# EAGLE board LCD-OLINUXINO-10''TS (EAGLE 4.16)
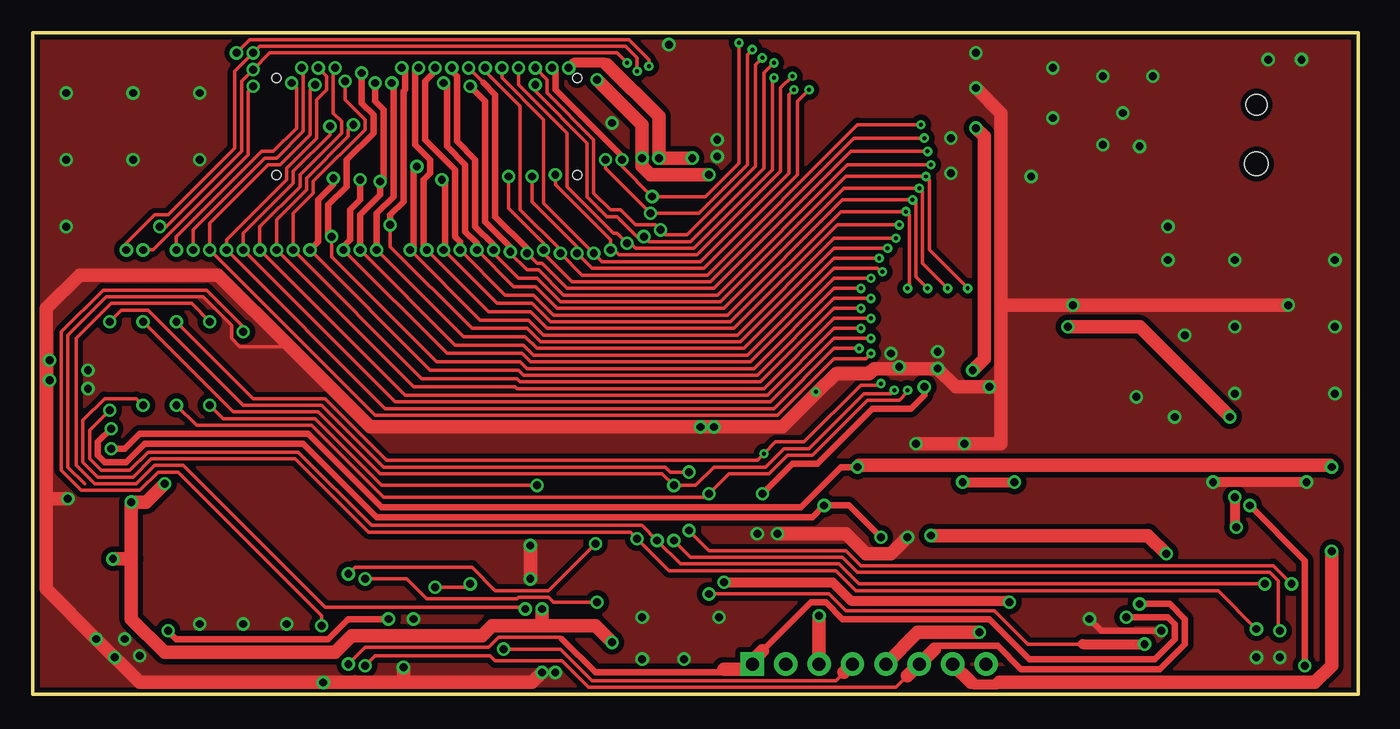
[diagram p1: board, top side]
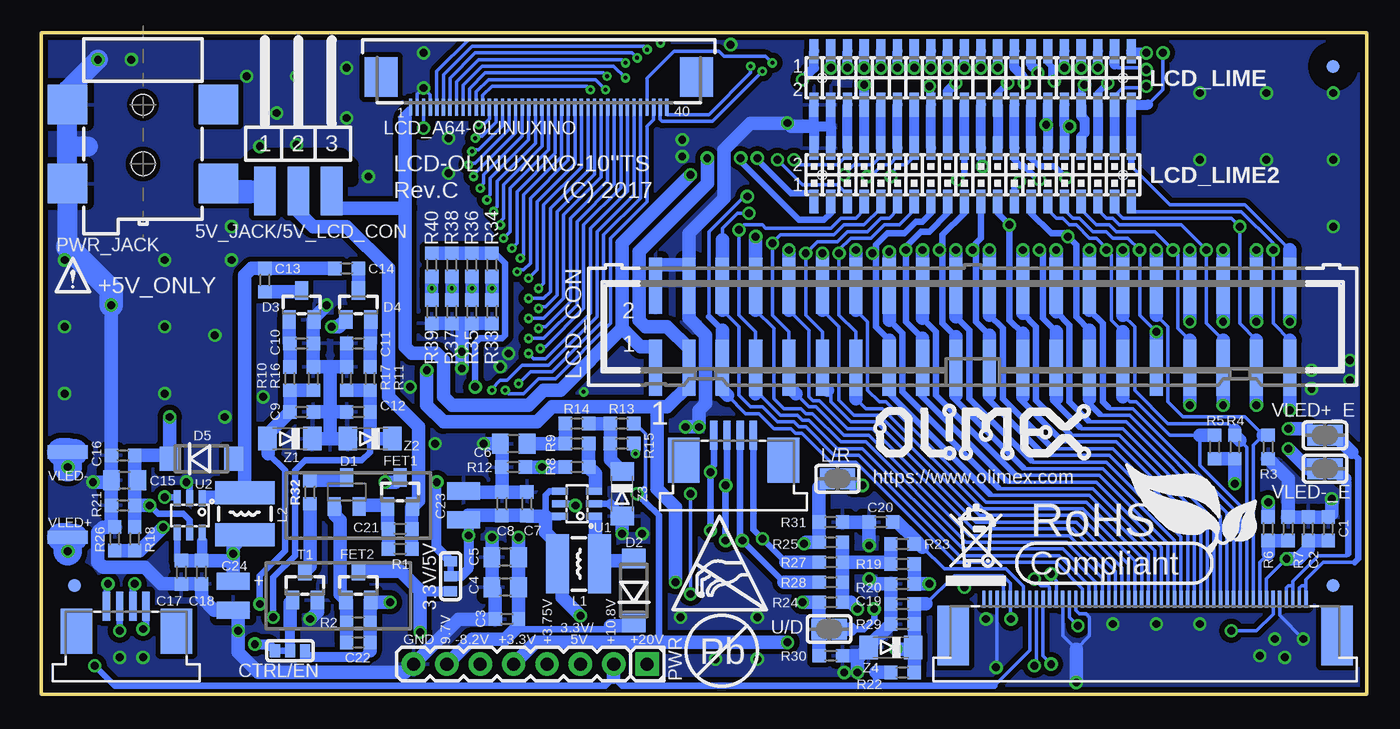
[diagram p2: board, bottom side, seen from below]

Size 100.84 x 50.29 mm. Coordinates in mm from the lower left corner, seen from the top.
Outline: 0,0 100.84,0 100.84,50.29 0,50.29 0,0
Copper layers (1+16): Top 0.035mm / dielectric 1.5mm / Bottom 0.035mm
Design rules "default": minimum track width 9.5mil, minimum drill 0.3mm, track to track 9mil, track to pad 9mil, pad to pad 9.5mil, via to via 9.5mil, smd to smd 1mil, copper to edge 10mil, drill to drill 8mil, minimum pad ring 8mil, minimum via ring 8mil, stop-mask expansion 4mil, vias tented up to drill 25mil, thermal gap 20mil
Net classes: 1 pwr: width 0.254 mm, drill 0.241 mm, clearance 0.254 mm
bRestrict: 6 lines

## Footprints (pad centres in the part's own frame; a part is rotated, then mirrored left to right if it is on the bottom)
SJ_2_SMALL_12_TIED = smd 0.762 x 1.016: 1 -1.143,0; 2 0,0; 3 1.143,0
HN1X3-SMD = smd 1.651 x 3.683: 1 -2.54,-0.229; 2 0,-0.229; 3 2.54,-0.229
C0603_DWS = smd 1.016 x 1.016: 1 -0.889,0; 2 0.889,0
C0805_5MIL_DWS = smd 1.27 x 1.524: 1 -1.016,0; 2 1.016,0
C-SMD5X11-M = smd 2.5 x 1.3: + 0,-1.1; - 0,1.1
SJ_2_SMALL_23_TIED = smd 0.762 x 1.016: 1 -1.143,0; 2 0,0; 3 1.143,0
SOT23C = smd 1.4 x 1: 1 1.1,-0.95; 2 1.1,0.95; 3 -1.1,0
MLL-41 = smd 1.45 x 1.8: A 2.445,0; K -2.445,0
SOT23C(BAT54S) = smd 1.4 x 1: 1 1.1,-0.95; 2 1.1,0.95; 3 -1.1,0
SOT23 = smd 1.4 x 1: 1 1.1,-0.95; 2 1.1,0.95; 3 -1.1,0
CD42(43) = smd 1.75 x 4.5: 1 -1.6,0; 2 1.6,0
SJ = smd 1.168 x 1.6: 1 -0.762,0; 2 0.762,0
LCD10"_TOUCH(F101T50) = smd 0.25 x 1.3 bottom: 1 104.95,54.35; 2 105.45,54.35; 3 105.95,54.35; 4 106.45,54.35; 5 106.95,54.35; 6 107.45,54.35; 7 107.95,54.35; 8 108.45,54.35; 9 108.95,54.35; 10 109.45,54.35; 11 109.95,54.35; 12 110.45,54.35; 13 110.95,54.35; 14 111.45,54.35; 15 111.95,54.35; 16 112.45,54.35; 17 112.95,54.35; 18 113.45,54.35; 19 113.95,54.35; 20 114.45,54.35; 21 114.95,54.35; 22 115.45,54.35; 23 115.95,54.35; 24 116.45,54.35; 25 116.95,54.35; 26 117.45,54.35; 27 117.95,54.35; 28 118.45,54.35; 29 118.95,54.35; 30 119.45,54.35; 31 119.95,54.35; 32 120.45,54.35; 33 120.95,54.35; 34 121.45,54.35; 35 121.95,54.35; 36 122.45,54.35; 37 122.95,54.35; 38 123.45,54.35; 39 123.95,54.35; 40 124.45,54.35; 41 124.95,54.35; 42 125.45,54.35; 43 125.95,54.35; 44 126.45,54.35; 45 126.95,54.35; 46 127.45,54.35; 47 127.95,54.35; 48 128.45,54.35; 49 128.95,54.35; 50 129.45,54.35 | smd 0.55 x 2.2 bottom: 51 193.195,53.799; 52 194.195,53.799; 53 195.195,53.799; 54 196.195,53.799; 55 146.995,66.799; 56 147.995,66.799; 57 148.995,66.799; 58 149.995,66.799 | smd 2.4 x 4.5 bottom: P1 131.8,51.575; P2 102.6,51.575 | smd 2.4 x 3.4 bottom: P3 190.895,51.899; P4 198.495,51.899; P5 144.695,64.899; P6 152.295,64.899
FPV-WZA21-40-LF = smd 0.25 x 1.3: 1 -9.75,-2.75; 2 -9.25,-2.75; 3 -8.75,-2.75; 4 -8.25,-2.75; 5 -7.75,-2.75; 6 -7.25,-2.75; 7 -6.75,-2.75; 8 -6.25,-2.75; 9 -5.75,-2.75; 10 -5.25,-2.75; 11 -4.75,-2.75; 12 -4.25,-2.75; 13 -3.75,-2.75; 14 -3.25,-2.75; 15 -2.75,-2.75; 16 -2.25,-2.75; 17 -1.75,-2.75; 18 -1.25,-2.75; 19 -0.75,-2.75; 20 -0.25,-2.75; 21 0.25,-2.75; 22 0.75,-2.75; 23 1.25,-2.75; 24 1.75,-2.75; 25 2.25,-2.75; 26 2.75,-2.75; 27 3.25,-2.75; 28 3.75,-2.75; 29 4.25,-2.75; 30 4.75,-2.75; 31 5.25,-2.75; 32 5.75,-2.75; 33 6.25,-2.75; 34 6.75,-2.75; 35 7.25,-2.75; 36 7.75,-2.75; 37 8.25,-2.75; 38 8.75,-2.75; 39 9.25,-2.75; 40 9.75,-2.75 | smd 2.5 x 3: P1 12,-0.45; P2 -12,-0.45
ML40-MALE(GBH-254-SMT-40) = smd 1 x 4.25: 1 -24.13,-3.125; 2 -24.13,3.125; 3 -21.59,-3.125; 4 -21.59,3.125; 5 -19.05,-3.125; 6 -19.05,3.125; 7 -16.51,-3.125; 8 -16.51,3.125; 9 -13.97,-3.125; 10 -13.97,3.125; 11 -11.43,-3.125; 12 -11.43,3.125; 13 -8.89,-3.125; 14 -8.89,3.125; 15 -6.35,-3.125; 16 -6.35,3.125; 17 -3.81,-3.125; 18 -3.81,3.125; 19 -1.27,-3.125; 20 -1.27,3.125; 21 1.27,-3.125; 22 1.27,3.125; 23 3.81,-3.125; 24 3.81,3.125; 25 6.35,-3.125; 26 6.35,3.125; 27 8.89,-3.125; 28 8.89,3.125; 29 11.43,-3.125; 30 11.43,3.125; 31 13.97,-3.125; 32 13.97,3.125; 33 16.51,-3.125; 34 16.51,3.125; 35 19.05,-3.125; 36 19.05,3.125; 37 21.59,-3.125; 38 21.59,3.125; 39 24.13,-3.125; 40 24.13,3.125
YA-V36P-2X20-LF = smd 0.7 x 1.8: 1 -12.065,2.032; 2 -12.065,-2.032; 3 -10.795,2.032; 4 -10.795,-2.032; 5 -9.525,2.032; 6 -9.525,-2.032; 7 -8.255,2.032; 8 -8.255,-2.032; 9 -6.985,2.032; 10 -6.985,-2.032; 11 -5.715,2.032; 12 -5.715,-2.032; 13 -4.445,2.032; 14 -4.445,-2.032; 15 -3.175,2.032; 16 -3.175,-2.032; 17 -1.905,2.032; 18 -1.905,-2.032; 19 -0.635,2.032; 20 -0.635,-2.032; 21 0.635,2.032; 22 0.635,-2.032; 23 1.905,2.032; 24 1.905,-2.032; 25 3.175,2.032; 26 3.175,-2.032; 27 4.445,2.032; 28 4.445,-2.032; 29 5.715,2.032; 30 5.715,-2.032; 31 6.985,2.032; 32 6.985,-2.032; 33 8.255,2.032; 34 8.255,-2.032; 35 9.525,2.032; 36 9.525,-2.032; 37 10.795,2.032; 38 10.795,-2.032; 39 12.065,2.032; 40 12.065,-2.032 | hole 0.7: -11.43,0; 11.43,0
GPH127SMT-02X20(PA-V16X-2X20-LF) = smd 0.7 x 1.8: 1 -12.065,-2.032; 2 -12.065,2.032; 3 -10.795,-2.032; 4 -10.795,2.032; 5 -9.525,-2.032; 6 -9.525,2.032; 7 -8.255,-2.032; 8 -8.255,2.032; 9 -6.985,-2.032; 10 -6.985,2.032; 11 -5.715,-2.032; 12 -5.715,2.032; 13 -4.445,-2.032; 14 -4.445,2.032; 15 -3.175,-2.032; 16 -3.175,2.032; 17 -1.905,-2.032; 18 -1.905,2.032; 19 -0.635,-2.032; 20 -0.635,2.032; 21 0.635,-2.032; 22 0.635,2.032; 23 1.905,-2.032; 24 1.905,2.032; 25 3.175,-2.032; 26 3.175,2.032; 27 4.445,-2.032; 28 4.445,2.032; 29 5.715,-2.032; 30 5.715,2.032; 31 6.985,-2.032; 32 6.985,2.032; 33 8.255,-2.032; 34 8.255,2.032; 35 9.525,-2.032; 36 9.525,2.032; 37 10.795,-2.032; 38 10.795,2.032; 39 12.065,-2.032; 40 12.065,2.032 | hole 0.7: -11.43,0; 11.43,0
HN1X8 = drill 1 pad 1.778 square: 1 -8.89,0 | drill 1 pad 1.778 round: 2 -6.35,0; 3 -3.81,0; 4 -1.27,0; 5 1.27,0; 6 3.81,0; 7 6.35,0; 8 8.89,0
PWR-JACK-SMD = smd 3 x 3: 1 6,5.75; 2 0,-5.75; 3 6,-5.75; 4 0,5.75 | hole 1.6: 0,0 | hole 1.8: 4.5,0
R0603_5MIL_DWS = smd 1.016 x 1.016: 1 -0.889,0; 2 0.889,0
SOT-23 = smd 1.4 x 1: 1 1.1,-0.95; 2 1.1,0.95; 3 -1.1,0
SOT23-6 = smd 1.2 x 0.55: 1 1.3,-0.95; 2 1.3,0; 3 1.3,0.95; 4 -1.3,0.95; 5 -1.3,0; 6 -1.3,-0.95
FIDUCIAL-1X3 = smd 1 x 1: 1 0,0
SMD120X40 = smd 3.048 x 1.016: 1 0,0
MINI-MELF = smd 1.4 x 1.8: 1 -1.7,0; 2 1.7,0

## Placement (x,y rotation side)
3.3V/5V  5V:Close/3.3V:Open  [SJ_2_SMALL_12_TIED]  69.69,8.97 270 bottom
5V_JACK/5V_LCD_CON  H-WX-1x3  [HN1X3-SMD]  81.28,38.48 0 bottom
C1  22uF/6.3V  [C0603_DWS]  2.92,12.57 90 bottom
C2  100nF  [C0603_DWS]  4.45,12.57 90 bottom
C3  100nF  [C0603_DWS]  65.41,5.71 180 bottom
C4  1uF/25V  [C0805_5MIL_DWS]  65.53,8.13 180 bottom
C5  1uF/25V  [C0805_5MIL_DWS]  65.53,10.41 180 bottom
C6  10uF/16V  [C0805_5MIL_DWS]  64.9,19.05 180 bottom
C7  22uF/6.3V  [C0603_DWS]  63.88,14.48 270 bottom
C8  22uF/6.3V  [C0603_DWS]  65.79,14.48 270 bottom
C9  100nF  [C0603_DWS]  81.03,21.46 0 bottom
C10  100nF  [C0603_DWS]  81.03,26.67 0 bottom
C11  100nF  [C0603_DWS]  76.71,26.67 180 bottom
C12  100nF  [C0603_DWS]  76.71,21.46 180 bottom
C13  100nF  [C0603_DWS]  83.82,31.5 90 bottom
C14  100nF  [C0603_DWS]  77.6,32.38 0 bottom
C15  10uF/16V  [C0805_5MIL_DWS]  94.49,16.26 180 bottom
C16  100nF  [C0603_DWS]  94.61,18.16 180 bottom
C17  22uF/6.3V  [C0603_DWS]  90.17,9.27 90 bottom
C18  22uF/6.3V  [C0603_DWS]  88.65,9.27 90 bottom
C19  100nF  [C0603_DWS]  35.31,6.86 180 bottom
C20  100nF  [C0603_DWS]  36.96,13.08 180 bottom
C21  22uF/6.3V  [C0603_DWS]  73.53,12.57 180 bottom
C22  100nF  [C0603_DWS]  76.71,3.94 180 bottom
C23  NA(100uF/16V)  [C-SMD5X11-M]  68.71,14.35 0 bottom
C24  NA(100uF/16V)  [C-SMD5X11-M]  86.23,7.49 180 bottom
CTRL/EN  CTRL:Close/EN:Open  [SJ_2_SMALL_23_TIED]  81.92,3.3 180 bottom
D1  BAT54C  [SOT23C]  77.6,15.37 270 bottom
D2  1N5819/SS14  [MLL-41]  55.75,7.87 90 bottom
D3  BAT54S  [SOT23C(BAT54S)]  81.03,29.59 270 bottom
D4  BAT54S  [SOT23C(BAT54S)]  76.71,29.59 270 bottom
D5  1N5819/SS14  [MLL-41]  88.65,17.91 0 bottom
FET1  IRLML6402  [SOT23]  73.53,15.37 270 bottom
FET2  IRLML6402  [SOT23]  76.71,8.26 270 bottom
L1  4.7uH/1.15A/DCR<0.1R/CD43  [CD42(43)]  59.94,9.91 0 bottom
L2  4.7uH/1.15A/DCR<0.1R/CD43  [CD42(43)]  85.34,13.72 90 bottom
L/R  Open  [SJ]  40.26,16.38 0 bottom
LCD  F101T50+(FPV-WZA21-50-LF)+(FPA-WZB25-04-LF)  [LCD10"_TOUCH(F101T50)]  -100.33,-47.12 0 top
LCD_A64-OLINUXINO  FPV-WZA21-40LF  [FPV-WZA21-40-LF]  62.99,47.37 0 bottom
LCD_CON  ML40-GBH-254-SMT-40  [ML40-MALE(GBH-254-SMT-40)]  29.97,27.94 0 bottom
LCD_LIME  GPH127SMT-02x20  [YA-V36P-2X20-LF]  29.97,46.86 0 bottom
LCD_LIME2  GPH127SMT-02x20  [GPH127SMT-02X20(PA-V16X-2X20-LF)]  29.97,39.5 0 bottom
PWR  NA(HN1X8)  [HN1X8]  63.63,2.29 180 bottom
PWR_JACK  DCJ-W54R-20-LF  [PWR-JACK-SMD]  93.09,44.83 270 bottom
R1  20k/1%  [R0603_5MIL_DWS]  73.53,11.05 0 bottom
R2  20k/1%  [R0603_5MIL_DWS]  76.71,5.46 0 bottom
R3  NA  [R0603_5MIL_DWS]  7.49,18.8 90 bottom
R4  NA  [R0603_5MIL_DWS]  10.03,18.8 90 bottom
R5  NA  [R0603_5MIL_DWS]  11.56,18.8 90 bottom
R6  NA  [R0603_5MIL_DWS]  7.49,12.57 270 bottom
R7  10k  [R0603_5MIL_DWS]  5.97,12.57 270 bottom
R8  2.2k  [R0603_5MIL_DWS]  60.07,17.27 180 bottom
R9  20k/1%  [R0603_5MIL_DWS]  60.07,19.05 180 bottom
R10  1.05k/1%  [R0603_5MIL_DWS]  81.92,24 90 bottom
R11  1.05k/1%  [R0603_5MIL_DWS]  75.82,24 90 bottom
R12  1.1R  [R0603_5MIL_DWS]  64.9,17.27 180 bottom
R13  4.7k  [R0603_5MIL_DWS]  56.64,20.57 0 bottom
R14  4.7k  [R0603_5MIL_DWS]  60.07,20.57 180 bottom
R15  220R  [R0603_5MIL_DWS]  56.64,19.05 180 bottom
R16  56.2k/1%  [R0603_5MIL_DWS]  80.14,24 270 bottom
R17  56.2k/1%  [R0603_5MIL_DWS]  77.6,24 270 bottom
R18  56.2k/1%  [R0603_5MIL_DWS]  93.73,11.81 90 bottom
R19  10k  [R0603_5MIL_DWS]  35.31,9.91 0 bottom
R20  NA  [R0603_5MIL_DWS]  35.31,8.38 0 bottom
R21  20k/1%  [R0603_5MIL_DWS]  94.61,14.35 0 bottom
R22  1.05k/1%  [R0603_5MIL_DWS]  35.31,1.65 0 bottom
R23  10k  [R0603_5MIL_DWS]  35.31,11.43 0 bottom
R24  NA  [R0603_5MIL_DWS]  40.77,6.99 180 bottom
R25  10k  [R0603_5MIL_DWS]  40.77,11.56 180 bottom
R26  1.05k/1%  [R0603_5MIL_DWS]  95.25,11.81 90 bottom
R27  NA  [R0603_5MIL_DWS]  40.77,10.03 180 bottom
R28  NA  [R0603_5MIL_DWS]  40.77,8.51 180 bottom
R29  562R/1%  [R0603_5MIL_DWS]  35.31,5.33 180 bottom
R30  10k  [R0603_5MIL_DWS]  40.77,2.92 0 bottom
R31  NA  [R0603_5MIL_DWS]  40.77,13.08 0 bottom
R32  1.05k/1%  [R0603_5MIL_DWS]  80.39,15.37 90 bottom
R33  47k  [R0603_5MIL_DWS]  66.55,29.08 90 bottom
R34  NA  [R0603_5MIL_DWS]  66.55,32.64 90 bottom
R35  NA  [R0603_5MIL_DWS]  68.07,29.08 90 bottom
R36  47k  [R0603_5MIL_DWS]  68.07,32.64 90 bottom
R37  47k  [R0603_5MIL_DWS]  69.6,29.08 90 bottom
R38  NA  [R0603_5MIL_DWS]  69.6,32.64 90 bottom
R39  47k  [R0603_5MIL_DWS]  71.12,29.08 90 bottom
R40  NA  [R0603_5MIL_DWS]  71.12,32.64 90 bottom
T1  DTC114YKA  [SOT-23]  80.77,8.26 270 bottom
U1  AP3031KTR-G1  [SOT23-6]  60.07,14.48 0 bottom
U2  AP3031KTR-G1  [SOT23-6]  89.53,13.59 90 bottom
U$1  FIDUCIAL  [FIDUCIAL-1X3]  2.54,8.26 270 bottom
U$2  FIDUCIAL  [FIDUCIAL-1X3]  98.3,8.26 270 bottom
U$3  FIDUCIAL  [FIDUCIAL-1X3]  2.54,47.75 270 bottom
U$4  [ATTENTION_SMALL]  99.69,30.61 0 bottom
U$8  [OLIMEX1_V]  19.81,17.65 0 bottom
U$9  [PB]  49.05,3.31 0 bottom
U$10  [ESD_SYMBOL]  52.78,6.42 0 bottom
U$11  [RECYCLE_BIN1/8]  32,8.26 0 bottom
U$12  [ROHS]  25.61,9.06 0 bottom
U/D  Open  [SJ]  40.89,4.95 0 bottom
VLED+  TESTPAD120X40  [SMD120X40]  98.81,11.94 180 bottom
VLED+_E  NA  [SJ]  3.17,19.68 180 bottom
VLED-  TESTPAD120X40  [SMD120X40]  98.81,18.41 180 bottom
VLED-_E  NA  [SJ]  3.17,17.14 180 bottom
Z1  BZV55C5V1  [MINI-MELF]  81.92,19.43 180 bottom
Z2  BZV55C20  [MINI-MELF]  75.82,19.43 180 bottom
Z3  NA(BZV55C3V0)  [MINI-MELF]  56.64,15.24 270 bottom
Z4  NA(BZV55C3V9)  [MINI-MELF]  36.2,3.56 180 bottom

## Tracks (layer width: path | path; a pad name or v marks a point on that pad's centre or on a via)
+5V  (via drill 0.6)
  Top 1.016: v68.33,12.06 84.84,12.06 v86.23,10.67 | PWR.3 v59.82,5.97
  Bottom 0.508: 63.82,13.53 C7.2 | U1.4 62.17,15.43 62.48,15.11 62.48,13.53 | 88.58,11.62 U2.6 | C17.2 90.48,10.16 U2.4
  Bottom 0.61: 62.48,13.53 U1.6
  Bottom 0.762: 3.3V/5V.2 68.88,8.97 68.33,9.53 v68.33,12.06 68.33,12.87 C23.+
  Bottom 0.813: 88.58,10.16 88.58,11.62
  Bottom 1.016: L2.1 86.23,11.23 v86.23,10.67 86.23,10.16 | 86.23,10.16 C24.+ | C17.2 C18.2 88.58,10.16 86.23,10.16 | C23.+ 68.37,13.59 C8.2 C7.2 | 63.82,13.53 62.48,13.53 62.48,12.32 61.54,11.38 L1.1 61.21,9.58 61.21,7.37 v59.82,5.97
+12V  (via drill 0.6)
  Top 0.508: v96.77,2.16 96.77,10.16 v92.58,14.35
  Top 1.016: v91.06,21.08 84.2,27.94 v78.74,27.94
  Bottom 0.254: LCD.43 25.62,3.34 28.32,0.64
  Bottom 0.508: v92.58,14.35 91.95,13.72 90.04,13.72 89.53,13.21 U2.5 | 28.32,0.64 37.34,0.64 | 37.34,0.64 56.64,0.64 57.28,1.27 57.91,0.64 95.25,0.64 v96.77,2.16 | 37.34,0.64 37.34,1.65
  Bottom 1.016: R21.2 93.73,16.26 C15.1 93.73,16.51 C16.1 91.34,18.16 D5.K 91.06,17.94 v91.06,21.08 | v92.58,14.35 R21.2 | R21.2 R18.2 | 37.34,1.65 R22.1 | 57.28,1.27 PWR.2 | D4.1 78.21,27.94 v78.74,27.94
+15V  (via drill 0.6)
  Top 0.254: v24,2.29 25.27,3.56 34.67,3.56 35.43,4.32 40.13,4.32 40.26,4.19
  Top 0.508: 40.26,4.19 42.8,1.65 52.32,1.65 52.58,1.91 | v83.19,5.84 86.36,5.84 86.87,5.33 86.87,4.19 85.34,2.67 75.82,2.67 72.77,5.71 61.59,5.71 60.33,6.99 59.18,6.99 55.5,3.3
  Top 1.016: 52.58,1.91 54.48,1.91 54.48,2.03 PWR.1 54.74,2.54 55.5,3.3
  Bottom 0.254: v24,2.29 24.62,2.9 LCD.41
  Bottom 0.508: v83.19,5.84 83.19,8.89 81.53,10.54 81.53,17.02 80.77,17.78 76.45,17.78 75.82,18.41 75.82,19.43
  Bottom 0.762: 74.12,19.35 Z2.1
  Bottom 1.016: R17.2 R11.1 C12.1 75.82,19.43 74.2,19.43 74.12,19.35
-24V  (via drill 0.6)
  Top 0.254: 66.55,1.4 65.66,0.51 42.29,0.51 40.26,2.54 35.18,2.54 34.8,2.92 26.04,2.92 v25.27,2.16
  Top 0.508: 68.58,3.43 68.83,3.68 73.41,3.68 75.18,1.91 85.72,1.91 87.63,3.81 87.63,5.71 86.49,6.86 v84.2,6.86
  Top 1.016: 68.58,3.43 PWR.6 66.55,1.4
  Bottom 0.254: LCD.42 25.12,2.31 v25.27,2.16
  Bottom 0.508: 83.57,18.29 82.3,17.02 82.3,10.92 84.2,9.02 v84.2,6.86
  Bottom 1.016: R16.2 R10.1 C9.1 83.61,19.76 Z1.2 83.57,19.38 83.57,18.29
GND  (via drill 0.3, 0.6)
  Top 0.254: 59.69,22.99 v59.56,22.99 | 19.56,26.42 15.75,26.42 15.11,27.05 15.11,28.07 12.95,30.23 5.59,30.23 2.67,27.3 2.67,17.27 3.94,16
  Top 0.508: v80.39,5.71 81.28,4.83 v85.85,4.83
  Top 0.762: v96.9,16.13 v89.79,16.13
  Top 1.016: 1.02,14.86 1.02,29.34 3.56,31.88 14.1,31.88 19.56,26.42 25.65,20.32 v50.8,20.32 v51.82,20.32 57.02,20.32 59.69,22.99 61.09,24.38 63.63,24.38 64.01,24.77 v68.83,24.77 70.23,23.37 73.66,23.37 | 1.02,14.86 v2.67,14.86 | 1.02,14.86 1.02,8 v4.83,4.19 8.13,0.89 v22.1,0.89 28.19,0.89 | 28.19,0.89 37.97,0.89 v38.73,1.65 | 28.19,0.89 v28.19,2.03 | 73.66,29.59 v79.12,29.59 v95.5,29.59 | v37.85,8.76 v37.85,11.3 | v56.64,12.19 61.85,12.19 63.37,10.67 65.28,10.67 v66.55,11.94 | 73.66,23.37 73.66,19.05 v67.18,19.05 | 73.66,23.37 73.66,29.59 | 73.66,29.59 73.66,44.2 v71.75,46.1
  Bottom 0.254: LCD.38 23.12,4.45 22.1,3.43 21.08,4.45 21.08,5.84 21.34,6.1 21.84,6.1 22.12,6.37 LCD.36 | LCD.48 28.12,2.11 v28.19,2.03 | LCD.5 6.62,5.99 v4.83,4.19 | LCD_A64-OLINUXINO.2 72.24,45.61 v71.75,46.1 71.24,45.59 LCD_A64-OLINUXINO.4
  Bottom 0.508: U2.2 89.53,15.88 v89.79,16.13 | 57.53,14.48 U1.2
  Bottom 0.762: Z3.2 56.64,13.59 57.53,14.48 | 40.77,43.18 LCD_LIME2.4 | 42.04,43.18 40.77,43.18 | 42.04,43.18 LCD_LIME2.2 | 40.77,43.18 LCD_LIME.4 | 42.04,43.18 LCD_LIME.2
  Bottom 1.016: R3.1 5.97,16.38 R7.1 C2.2 C1.2 2.67,13.72 v2.67,14.86 | C15.2 C16.2 v95.5,29.59 | C15.2 R21.1 95.5,12.95 R26.2 96.14,12.7 96.52,12.32 96.52,10.03 96.14,9.65 92.96,9.65 91.69,8.38 C17.1 C18.1 88.65,7.37 87.67,6.39 C24.- 85.85,6.01 v85.85,4.83 85.85,3.17 84.33,1.65 73.15,1.65 PWR.8 69.09,5.71 C3.2 66.29,7.87 C4.2 C5.2 v66.55,11.94 | C11.2 R17.1 78.87,24.89 | 78.87,19.43 Z2.2 | 78.87,19.43 Z1.1 | 78.87,24.89 R16.1 C10.2 80.14,28.43 D3.2 80.08,28.64 v79.12,29.59 | 78.87,24.89 78.87,21.46 | 78.87,21.46 C12.2 | 78.87,21.46 C9.2 | 78.87,21.46 78.87,19.43 | T1.2 79.82,6.28 v80.39,5.71 | 51.56,32.64 54.1,32.64 LCD_CON.2 | C23.- 68.66,15.49 68.54,15.37 C8.1 | C8.1 C7.1 | C8.1 R12.2 65.79,19.05 | 38.73,2.92 38.53,2.92 Z4.2 37.9,3.63 R29.2 C19.2 R20.1 37.47,8.38 v37.85,8.76 | 38.73,2.92 R30.2 | v38.73,1.65 38.73,2.92 | v22.1,0.89 22.1,3.43 | v37.85,11.3 C20.2 R31.2 | C15.2 95.5,16.13 v96.9,16.13 | v56.64,12.19 Z3.2 | v67.18,19.05 65.79,19.05 | 65.79,19.05 C6.2 | 51.56,30.99 51.56,28.57 50.29,27.3 50.29,22.1 50.8,21.59 v50.8,20.32 v51.82,20.32 | 51.56,30.99 LCD_CON.4 | 42.04,43.18 43.81,43.18 v44.07,43.43 46.86,43.43 48.9,41.4 48.9,37.72 51.56,35.05 51.56,32.64 | 51.56,30.99 51.56,32.64 | R35.1 R33.1 R35.1 | 68.83,28.19 R37.1 R39.1 | v68.83,24.77 v68.83,26.04 68.83,28.19 | 68.83,28.19 R35.1
  Bottom 1.524: 98.84,41.66 PWR_JACK.2 98.84,45.94 v96.52,48.26 | 98.84,41.66 PWR_JACK.3 98.81,38.83 98.81,34.04 | 98.84,41.66 97.28,41.66
  Bottom 1.778: 98.81,34.04 95.5,30.73 v95.5,29.59
  other vias: 12.7,5.33 16,5.33 19.3,5.33 46.35,5.84 52.2,5.84 93.09,2.79 94.87,2.79 1.27,23.88 87.63,27.3 86.87,21.08 1.27,25.4 86.36,35.56 86.36,33.02 91.44,33.02 83.95,22.61 2.54,45.72 7.62,45.72 7.62,40.64 2.54,40.64 12.7,40.64 12.7,45.72 2.54,35.56 91.44,27.94 91.44,22.86 99.06,22.86 99.06,27.94 99.06,33.02 52.07,40.89 52.07,42.16 48.39,49.4 4.19,24.64 4.19,23.24 6.99,4.19 8.13,2.92 6.22,2.79 46.35,2.67 49.53,2.67 55.12,12.19 39.75,1.65 72.77,23.37 70.87,19.05 69.85,39.62 69.85,42.29 81.41,46.99 85.22,46.99 82.93,44.2 81.41,41.78 84.2,41.66 93.98,48.26 71.75,48.77 28.96,5.71 77.6,43.81 77.6,47.62 75.95,39.37 65.28,25.91 65.91,24.89
  pour Top (isolate 0.406, rank 2): -7.62,52.83 -7.62,-2.54 103.38,-2.54 103.38,52.83
  pour Bottom (isolate 0.406, rank 3): -10.16,-5.08 105.92,-5.08 105.92,55.37 -10.16,55.37
LCD_B0  (via drill 0.3, 0.6)
  Top 0.254: v29.97,33.78 34.67,29.08 37.85,29.08 39.12,27.81 53.34,27.81 61.21,35.69 v65.91,35.69
  Top 0.508: v29.97,33.78 29.72,34.04 29.72,39.12 30.23,39.62 30.23,40.64 29.08,41.78 29.08,47.37 v29.34,47.62
  Bottom 0.254: LCD.19 13.62,12.22 19.56,18.16 24.51,18.16 24.64,18.29 | LCD_A64-OLINUXINO.21 62.74,41.65 65.66,38.73 65.66,36.2 65.91,35.94 v65.91,35.69
  Bottom 0.508: 24.64,18.29 28.7,22.35 28.7,22.73 | 28.7,27.3 29.72,28.32 29.72,33.78 | LCD_LIME2.21 29.34,34.67 29.72,34.29 29.72,33.78 | 29.72,33.78 v29.97,33.78
  Bottom 0.762: v29.34,47.62 LCD_LIME.21
  Bottom 1.016: 28.7,22.73 LCD_CON.21 28.7,27.3
LCD_B1  (via drill 0.3, 0.6)
  Top 0.254: v28.7,33.78 34.04,28.45 37.72,28.45 38.86,27.3 53.59,27.3 60.96,34.67 v65.66,34.67
  Top 0.508: v29.21,40.13 28.96,39.88 28.96,34.04 v28.7,33.78
  Bottom 0.254: LCD.18 13.12,12.48 19.3,18.67 23.88,18.67 24,18.8 | LCD_A64-OLINUXINO.22 62.24,41.39 65.15,38.48 65.15,35.18 v65.66,34.67
  Bottom 0.508: 28.7,28.83 27.69,27.81 27.69,22.48 24,18.8 | v29.21,40.13 29.34,40.26 LCD_LIME2.22
  Bottom 0.762: LCD_LIME2.22 LCD_LIME.22
  Bottom 1.016: 28.7,28.83 LCD_CON.22 v28.7,33.78
LCD_B2  (via drill 0.3, 0.6)
  Top 0.254: v27.18,35.69 27.18,34.04 33.4,27.81 37.59,27.81 38.61,26.8 53.85,26.8 60.96,33.91 v65.02,33.91
  Top 0.508: v27.18,35.69 27.18,36.45 28.19,37.47 28.19,45.85 28.32,45.97 28.32,47.37 v28.07,47.62
  Bottom 0.254: 23.24,19.3 23.11,19.18 19.05,19.18 12.62,12.75 LCD.17 | LCD_A64-OLINUXINO.23 61.74,41.13 64.64,38.23 64.64,34.29 v65.02,33.91
  Bottom 0.508: 23.24,19.3 26.16,22.23 26.16,22.61 | 26.16,27.43 27.18,28.45 v27.18,35.69 28.07,36.58 LCD_LIME2.23
  Bottom 0.762: v28.07,47.62 LCD_LIME.23
  Bottom 1.016: 26.16,22.61 LCD_CON.23 26.16,27.43
LCD_B3  (via drill 0.3, 0.6)
  Top 0.254: v26.16,33.78 32.77,27.18 37.47,27.18 38.35,26.29 54.1,26.29 60.96,33.15 v64.39,33.15
  Top 0.508: v26.16,33.78 26.16,36.58 27.43,37.85 27.43,46.35 v27.3,46.48
  Bottom 0.254: 22.61,19.81 22.48,19.68 18.8,19.68 12.12,13.01 LCD.16 | LCD_A64-OLINUXINO.24 61.24,40.87 64.14,37.97 64.14,33.4 v64.39,33.15
  Bottom 0.508: 26.16,28.96 25.15,27.94 25.15,22.35 22.61,19.81 | v27.3,46.48 28.07,45.72 LCD_LIME.24
  Bottom 0.762: LCD_LIME.24 LCD_LIME2.24
  Bottom 1.016: 26.16,28.96 LCD_CON.24 v26.16,33.78
LCD_B4  (via drill 0.3, 0.6)
  Top 0.254: v24.89,33.78 32.13,26.54 37.34,26.54 38.1,25.78 54.36,25.78 60.96,32.38 64.26,32.38 64.52,32.13 v64.64,32.13
  Top 0.508: v24.89,33.78 24.89,36.45 26.42,37.97 v26.42,38.99 26.67,39.24 26.67,44.45 26.04,45.09 v26.04,46.48
  Bottom 0.254: 21.84,20.32 21.72,20.19 18.54,20.19 11.62,13.27 LCD.15 | LCD_A64-OLINUXINO.25 60.74,40.6 63.63,37.72 63.63,32.77 64.14,32.26 64.52,32.26 v64.64,32.13
  Bottom 0.508: 21.84,20.32 23.62,22.1 23.62,22.48 | 23.62,27.56 24.64,28.57 24.64,33.53 v24.89,33.78 | v26.42,38.99 26.8,38.61 LCD_LIME2.25
  Bottom 0.762: v26.04,46.48 26.16,46.61 26.16,46.99 26.8,47.62 LCD_LIME.25
  Bottom 1.016: 23.62,22.48 LCD_CON.25 23.62,27.56
LCD_B5  (via drill 0.3, 0.6)
  Top 0.254: v23.62,33.78 31.5,25.91 37.21,25.91 37.85,25.27 54.61,25.27 60.96,31.62 v63.75,31.62
  Top 0.508: v24.89,39.12 24.89,37.59 24.13,36.83 24.13,34.54 23.62,34.04 v23.62,33.78
  Bottom 0.254: LCD.14 11.12,13.53 18.29,20.7 21.08,20.7 21.21,20.83 | LCD_A64-OLINUXINO.26 60.24,40.34 63.12,37.47 63.12,32.26 v63.75,31.62
  Bottom 0.508: 23.62,29.08 22.61,28.07 22.61,22.23 21.21,20.83 | v24.89,39.12 25.02,39.12 26.04,40.13 26.29,40.13 26.8,40.64 LCD_LIME2.26
  Bottom 0.762: LCD_LIME2.26 LCD_LIME.26
  Bottom 1.016: 23.62,29.08 LCD_CON.26 v23.62,33.78
LCD_B6  (via drill 0.3, 0.6)
  Top 0.254: v22.73,34.8 22.73,33.27 30.73,25.27 37.08,25.27 37.59,24.77 54.86,24.77 60.96,30.86 v62.99,30.86
  Top 0.508: v25.02,47.24 25.02,44.96 25.91,44.07 25.91,42.67 23.88,40.64 23.88,38.61 22.48,37.21 22.48,35.05 v22.73,34.8
  Bottom 0.254: LCD.13 10.62,13.79 18.03,21.21 20.19,21.21 20.32,21.34 | LCD_A64-OLINUXINO.27 59.74,40.08 62.61,37.21 62.61,31.24 v62.99,30.86
  Bottom 0.508: 20.32,21.34 21.08,22.1 21.08,22.48 | 21.08,27.69 22.1,28.7 22.1,34.16 v22.73,34.8 22.99,35.05 24,35.05 25.53,36.58 LCD_LIME2.27
  Bottom 0.762: v25.02,47.24 25.02,47.37 25.53,47.88 LCD_LIME.27
  Bottom 1.016: 21.08,22.48 LCD_CON.27 21.08,27.69
LCD_B7  (via drill 0.3, 0.6)
  Top 0.254: v21.08,33.78 30.23,24.64 36.96,24.64 37.34,24.26 55.12,24.26 60.96,30.1 v63.75,30.1
  Top 0.508: v21.08,33.78 21.72,34.42 21.72,37.59 22.86,38.73 v22.86,39.24
  Bottom 0.254: LCD.12 10.12,14.06 17.78,21.72 19.56,21.72 19.68,21.84 | LCD_A64-OLINUXINO.28 59.24,39.82 62.1,36.96 62.1,30.61 62.61,30.1 v63.75,30.1
  Bottom 0.508: 21.08,29.21 20.07,28.19 20.07,22.23 19.68,21.84 | v22.86,39.24 23.75,40.13 24.89,40.13 25.53,40.77 LCD_LIME2.28
  Bottom 0.762: LCD_LIME2.28 LCD_LIME.28
  Bottom 1.016: 21.08,29.21 LCD_CON.28 v21.08,33.78
LCD_BKL  (via drill 0.3, 0.6)
  Top 0.254: v10.92,28.32 16.76,22.48 22.23,22.48 26.92,17.78 55.12,17.78 v55.63,18.29 56.52,19.18 58.67,19.18 62.99,23.5 64.39,23.5 v64.52,23.62 | v19.68,46.48 20.07,46.1 20.07,43.05 18.29,41.27 17.4,41.27 10.92,34.8 v10.92,33.78
  Bottom 0.254: LCD_A64-OLINUXINO.36 55.24,37.72 58.04,34.92 58.04,28.45 61.98,24.51 63.63,24.51 v64.52,23.62
  Bottom 0.508: LCD_LIME.36 20.45,45.72 v19.68,46.48
  Bottom 0.762: v55.63,18.29 55.63,19.05 R15.1 | LCD_LIME.36 LCD_LIME2.36
  Bottom 1.016: v10.92,28.32 LCD_CON.36 v10.92,33.78
LCD_CLK  (via drill 0.3, 0.6)
  Top 0.254: v21.97,5.21 21.97,5.97 11.05,16.89 9.53,16.89 8.13,15.49 3.68,15.49 2.16,17.02 2.16,27.56 5.33,30.73 13.21,30.73 16,27.94 v16,27.56 | v22.99,47.62 22.86,47.5 22.86,44.2 23.5,43.56 23.5,42.67 20.32,39.5 20.32,38.61 17.27,35.56 v17.27,33.78 28.32,22.73 55.88,22.73 60.96,27.81 v62.99,27.81
  Bottom 0.254: LCD.37 22.62,5.86 v21.97,5.21 | v16,27.56 17.27,28.83 v17.27,33.78 18.16,34.67 19.3,34.67 19.81,35.18 20.83,35.18 21.84,36.2 22.35,36.2 22.99,36.83 LCD_LIME2.31 | LCD_A64-OLINUXINO.31 57.74,39.03 60.58,36.2 60.58,29.84 62.48,27.94 62.87,27.94 v62.99,27.81
  Bottom 0.762: v22.99,47.62 LCD_LIME.31
  Bottom 1.016: v16,27.56 LCD_CON.31
LCD_DE  (via drill 0.3, 0.6)
  Top 0.254: v22.61,43.18 22.61,42.55 19.81,39.75 19.81,38.86 16,35.05 v16,33.78 27.56,22.23 56.13,22.23 60.96,27.05 v63.75,27.05
  Bottom 0.254: 16,28.83 15.11,27.94 15.11,22.23 13.97,21.08 9.27,21.08 7.87,19.68 8.62,18.94 LCD.9 | LCD_A64-OLINUXINO.32 57.24,38.77 60.07,35.94 60.07,29.59 62.61,27.05 v63.75,27.05
  Bottom 0.762: 22.99,43.18 LCD_LIME2.32 | v22.61,43.18 22.99,43.18 | 22.99,43.18 LCD_LIME.32
  Bottom 1.016: 16,28.83 LCD_CON.32 v16,33.78 | 7.87,19.68 R3.2
LCD_G0  (via drill 0.3, 0.6)
  Top 0.254: v34.42,47.62 34.42,47.37 37.08,44.7 37.08,36.83 40.13,33.78 v40.13,33.53 41.78,31.88 51.31,31.88 62.74,43.31 v67.56,43.31
  Bottom 0.254: 38.86,22.48 38.1,21.72 36.83,21.72 29.21,14.1 21.59,14.1 17.62,10.13 LCD.27 | LCD_CON.13 38.86,27.56 40.13,28.83 v40.13,33.53 40.13,33.78 39.24,34.67 37.72,34.67 36.7,35.69 35.56,35.69 34.42,36.83 LCD_LIME2.13 | LCD_A64-OLINUXINO.13 66.74,43.75 67.06,43.43 67.44,43.43 v67.56,43.31
  Bottom 0.762: v34.42,47.62 LCD_LIME.13
  Bottom 1.016: 38.86,22.48 LCD_CON.13
LCD_G1  (via drill 0.3, 0.6)
  Top 0.254: v36.2,39.37 36.2,36.96 38.86,34.29 v38.86,33.78 38.86,33.53 41.02,31.37 51.56,31.37 62.48,42.29 v67.82,42.29
  Bottom 0.254: 38.86,29.21 37.97,28.32 37.97,23.11 37.08,22.23 36.58,22.23 28.96,14.61 21.34,14.61 17.12,10.39 LCD.26 | v36.2,39.37 36.2,39.62 35.56,40.26 35.05,40.26 34.42,40.89 LCD_LIME2.14 | LCD_A64-OLINUXINO.14 66.24,43.49 67.31,42.42 67.69,42.42 v67.82,42.29
  Bottom 0.762: LCD_LIME2.14 LCD_LIME.14
  Bottom 1.016: 38.86,29.21 LCD_CON.14 v38.86,33.78
LCD_G2  (via drill 0.3, 0.6)
  Top 0.254: 34.29,46.48 v33.15,47.62 | v37.59,33.53 38.35,32.77 38.73,32.77 40.64,30.86 51.82,30.86 62.23,41.27 v68.07,41.27
  Top 0.508: 34.29,46.48 35.18,45.59 35.18,36.32 37.59,33.91 v37.59,33.53
  Bottom 0.254: LCD.25 16.62,10.65 21.08,15.11 28.57,15.11 28.7,15.24 | LCD_A64-OLINUXINO.15 65.74,43.22 67.56,41.4 67.94,41.4 v68.07,41.27
  Bottom 0.508: 28.7,15.24 36.32,22.86 36.32,23.24 | 36.32,26.92 37.34,27.94 37.34,33.53 | LCD_LIME2.15 33.15,36.58 33.78,35.94 34.29,35.94 35.18,35.05 36.45,35.05 37.34,34.16 37.34,33.53 | 37.34,33.53 v37.59,33.53
  Bottom 0.762: v33.15,47.62 LCD_LIME.15
  Bottom 1.016: 36.32,23.24 LCD_CON.15 36.32,26.92
LCD_G3  (via drill 0.3, 0.6)
  Top 0.254: v36.32,33.66 36.32,33.53 37.59,32.26 38.48,32.26 40.39,30.35 52.07,30.35 61.98,40.26 v68.33,40.26
  Top 0.508: v33.27,46.23 34.42,45.09 34.42,35.94 36.32,34.04 v36.32,33.66
  Bottom 0.254: LCD.24 16.12,10.91 20.83,15.62 27.94,15.62 28.07,15.75 | LCD_LIME2.16 33.15,40.89 | LCD_A64-OLINUXINO.16 65.24,42.96 67.82,40.39 68.2,40.39 v68.33,40.26
  Bottom 0.508: 36.32,28.45 35.31,27.43 35.31,22.99 28.07,15.75 | v33.27,46.23 33.15,46.1 LCD_LIME2.16
  Bottom 0.762: LCD_LIME2.16 LCD_LIME.16
  Bottom 1.016: 36.32,28.45 LCD_CON.16 v36.32,33.66
LCD_G4  (via drill 0.3, 0.6)
  Top 0.254: v35.05,33.78 35.05,33.53 36.96,31.62 38.35,31.62 40.13,29.84 52.32,29.84 61.85,39.37 v67.94,39.37 68.2,39.12 68.2,33.78 v71.12,30.86
  Top 0.508: v31.88,47.62 31.88,47.37 32.26,46.99 32.26,42.04 33.66,40.64 33.66,35.56 35.05,34.16 v35.05,33.78
  Bottom 0.254: 27.43,16.26 27.3,16.13 20.57,16.13 15.62,11.18 LCD.23 | LCD_A64-OLINUXINO.17 64.74,42.7 67.94,39.5 v67.94,39.37
  Bottom 0.508: 27.43,16.26 33.78,22.61 33.78,22.99 | 33.78,27.05 35.05,28.32 v35.05,33.78 35.05,34.04 33.91,35.18 33.27,35.18 31.88,36.58 LCD_LIME2.17
  Bottom 0.762: v31.88,47.62 LCD_LIME.17
  Bottom 1.016: 33.78,22.99 LCD_CON.17 33.78,27.05 | R39.2 v71.12,30.86 R40.1
LCD_G5  (via drill 0.3, 0.6)
  Top 0.254: v33.78,33.78 36.58,30.99 38.23,30.99 39.88,29.34 52.58,29.34 61.72,38.48 v67.44,38.48 67.69,38.23 67.69,32.77 v69.6,30.86
  Top 0.508: v33.78,33.78 33.78,34.29 32.89,35.18 32.89,40.26 31.5,41.66 31.5,46.23 v31.24,46.48
  Bottom 0.254: LCD.22 15.12,11.44 20.32,16.64 26.67,16.64 26.8,16.76 | LCD_A64-OLINUXINO.18 64.24,42.44 67.18,39.5 67.18,38.86 67.44,38.61 v67.44,38.48
  Bottom 0.508: 33.78,28.57 32.77,27.56 32.77,22.73 26.8,16.76
  Bottom 0.762: LCD_LIME2.18 LCD_LIME.18 31.88,45.85 v31.24,46.48
  Bottom 1.016: 33.78,28.57 LCD_CON.18 v33.78,33.78 | R37.2 v69.6,30.86 R38.1
LCD_G6  (via drill 0.3, 0.6)
  Top 0.254: v32.51,33.78 35.94,30.35 38.1,30.35 39.62,28.83 52.83,28.83 61.59,37.59 v66.93,37.59 67.18,37.34 67.18,31.75 v68.07,30.86
  Top 0.508: v32.51,33.78 32.51,34.42 32.13,34.8 32.13,39.88 29.84,42.16 29.84,46.61 30.61,47.37 v30.61,47.62
  Bottom 0.254: LCD.21 14.62,11.7 20.07,17.14 26.04,17.14 26.16,17.27 | LCD_A64-OLINUXINO.19 63.74,42.18 66.67,39.24 66.67,37.97 66.93,37.72 v66.93,37.59
  Bottom 0.508: 26.16,17.27 31.24,22.35 31.24,22.73 | 31.24,27.18 32.26,28.19 32.26,33.78 | LCD_LIME2.19 30.61,36.58 32.26,34.92 32.26,33.78 | 32.26,33.78 v32.51,33.78
  Bottom 0.762: v30.61,47.62 LCD_LIME.19
  Bottom 1.016: 31.24,22.73 LCD_CON.19 31.24,27.18 | R35.2 v68.07,30.86 R36.1
LCD_G7  (via drill 0.3, 0.6)
  Top 0.254: v31.24,33.78 35.31,29.72 37.97,29.72 39.37,28.32 53.09,28.32 61.47,36.7 v66.42,36.7 66.67,36.45 66.67,30.99 v66.55,30.86
  Top 0.508: v31.24,33.78 31.37,33.91 31.37,38.86 v31.11,39.12
  Bottom 0.254: LCD.20 14.12,11.96 19.81,17.65 25.4,17.65 25.53,17.78 | LCD_A64-OLINUXINO.20 63.24,41.91 66.17,38.99 66.17,37.08 66.42,36.83 v66.42,36.7
  Bottom 0.508: 31.24,28.7 30.23,27.69 30.23,22.48 25.53,17.78 | v31.11,39.12 30.61,39.62 LCD_LIME2.20
  Bottom 0.762: LCD_LIME2.20 LCD_LIME.20
  Bottom 1.016: 31.24,28.7 LCD_CON.20 v31.24,33.78 | R33.2 v66.55,30.86 R34.1
LCD_HSYNC  (via drill 0.3, 0.6)
  Top 0.254: v23.75,46.61 23.75,45.21 25.27,43.69 25.27,42.93 21.34,38.99 21.34,38.1 19.81,36.58 v19.81,33.78 29.59,24 36.83,24 37.08,23.75 55.37,23.75 60.96,29.34 v62.99,29.34
  Bottom 0.254: LCD.11 9.62,14.32 12.7,17.4 12.7,19.68 14.99,19.68 17.53,22.23 18.03,22.23 18.41,22.61 18.54,22.61 | LCD_LIME2.29 24.26,36.83 23.62,36.2 23.11,36.2 22.61,35.69 22.1,35.69 21.08,34.67 20.57,34.67 19.81,33.91 v19.81,33.78 19.43,33.4 19.43,28.45 18.54,27.56 | LCD_A64-OLINUXINO.29 58.74,39.56 61.59,36.7 61.59,30.35 62.48,29.46 62.87,29.46 v62.99,29.34
  Bottom 0.508: v23.75,46.61 24,46.86 24,47.75 24.26,48.01 LCD_LIME.29
  Bottom 1.016: 12.7,19.68 R5.2 | 18.54,22.61 LCD_CON.29 18.54,27.56
LCD_L/R  (via drill 0.6)
  Top 0.254: v24,9.14 24.51,9.65 33.4,9.65 35.18,7.87 39.24,7.87 v42.8,11.43
  Bottom 0.254: LCD.39 23.62,8.63 24,9.02 v24,9.14
  Bottom 1.016: v42.8,11.43 42.67,11.56 R25.2 R31.1 41.66,15.75 L/R.1
LCD_PWRE  (via drill 0.3, 0.6)
  Top 0.254: v10.92,21.97 12.45,20.45 21.21,20.45 26.67,14.99 51.18,14.99 v51.44,15.24 52.96,16.76 56.01,16.76 57.4,18.16 59.31,18.16 63.5,22.35 65.91,22.35 66.55,22.99 v66.55,23.11 | 79.88,3.81 75.69,3.81 73.15,6.35 61.85,6.35 60.58,7.62 v51.44,7.62 | v12.19,33.78 12.19,35.31 17.65,40.77 18.54,40.77 20.57,42.8 20.57,47.5 v20.45,47.62
  Top 0.762: 79.88,3.81 v84.58,3.81
  Bottom 0.254: v51.44,15.24 v51.44,7.62 | 10.92,26.92 12.19,28.19 v12.19,33.78 14.1,35.69 18.8,35.69 19.3,36.2 19.81,36.2 20.45,36.83 LCD_LIME2.35 | LCD_A64-OLINUXINO.35 55.74,37.98 58.55,35.18 58.55,28.7 62.23,25.02 64.26,25.02 65.41,23.88 65.91,23.88 66.55,23.24 v66.55,23.11
  Bottom 0.762: v84.58,3.81 83.57,3.81 CTRL/EN.3 | v20.45,47.62 LCD_LIME.35
  Bottom 1.016: v10.92,21.97 LCD_CON.35 10.92,26.92
LCD_R0  (via drill 0.3, 0.6)
  Top 0.254: v44.83,40.64 44.83,40.13 v47.12,37.85 51.18,37.85 53.72,40.39 v53.72,49.53
  Top 0.508: v39.5,47.62 39.75,47.37 39.75,45.97 44.83,40.89 v44.83,40.64
  Bottom 0.254: LCD.35 21.62,8.03 23.62,10.03 31.24,10.03 38.86,17.65 40.77,17.65 42.95,19.84 43.46,19.84 43.81,20.19 45.09,20.19 46.23,21.34 47.24,21.34 48.64,22.73 | LCD_LIME2.5 39.5,37.97 40.26,38.73 42.93,38.73 v44.83,40.64 | 50.04,28.7 50.04,35.18 47.37,37.85 v47.12,37.85 | v53.72,49.53 53.98,49.78 68.33,49.78 70.74,47.37 LCD_A64-OLINUXINO.5
  Bottom 0.508: 49.02,27.69 50.04,28.7
  Bottom 0.762: v39.5,47.62 LCD_LIME.5
  Bottom 1.016: 48.64,22.73 49.02,23.11 LCD_CON.5 49.02,27.69
LCD_R1  (via drill 0.3, 0.6)
  Top 0.254: v43.56,40.64 43.56,40.01 v46.99,36.58 50.67,36.58 54.36,40.26 54.36,48.64 v54.74,49.02
  Bottom 0.254: 49.02,29.21 47.75,27.94 47.75,22.73 46.86,21.84 45.97,21.84 44.83,20.7 43.56,20.7 43.18,20.32 42.67,20.32 40.51,18.16 38.61,18.16 30.99,10.54 23.37,10.54 21.12,8.29 LCD.34 | 49.02,34.54 49.02,35.43 47.88,36.58 v46.99,36.58 | LCD_LIME2.6 39.62,41.4 39.62,40.89 40.26,40.26 43.18,40.26 v43.56,40.64 | v54.74,49.02 54.99,49.28 68.07,49.28 70.24,47.11 LCD_A64-OLINUXINO.6
  Bottom 0.762: LCD_LIME2.6 LCD_LIME.6
  Bottom 1.016: 49.02,29.21 LCD_CON.6 49.02,34.54
LCD_R2  (via drill 0.3, 0.6)
  Top 0.254: v38.23,47.62 39.12,46.74 39.12,45.72 42.67,42.16 42.67,38.1 43.94,36.83 44.7,36.83 45.85,35.69 47.37,35.69 v47.75,35.31 48.13,34.92 49.78,34.92 54.99,40.13 54.99,47.88 v55.5,48.39
  Bottom 0.254: 46.48,22.86 46.23,22.86 44.58,21.21 43.31,21.21 42.93,20.83 42.42,20.83 40.26,18.67 38.35,18.67 30.73,11.05 23.11,11.05 20.62,8.55 LCD.33 | LCD_CON.7 46.48,27.56 47.75,28.83 v47.75,35.31 47.37,35.69 45.97,35.69 45.72,35.43 40.77,35.43 40.01,36.2 38.86,36.2 38.23,36.83 LCD_LIME2.7 | v55.5,48.39 55.88,48.77 67.82,48.77 69.74,46.84 LCD_A64-OLINUXINO.7
  Bottom 0.762: v38.23,47.62 LCD_LIME.7
  Bottom 1.016: 46.48,22.86 LCD_CON.7
LCD_R3  (via drill 0.3, 0.6)
  Top 0.254: v38.23,46.35 38.23,45.85 42.16,41.91 42.16,37.85 43.69,36.32 44.45,36.32 45.97,34.8 v46.48,34.8 46.86,34.42 50.04,34.42 55.63,40.01 55.63,47.24 v56.39,48.01
  Bottom 0.254: 46.48,29.21 45.09,27.81 45.09,22.48 44.32,21.72 43.05,21.72 42.67,21.34 42.16,21.34 40.01,19.18 38.1,19.18 30.48,11.56 22.86,11.56 20.12,8.82 LCD.32 | v56.39,48.01 56.64,48.26 67.56,48.26 69.24,46.58 LCD_A64-OLINUXINO.8
  Bottom 0.762: 38.23,44.7 LCD_LIME2.8 | 38.23,44.7 LCD_LIME.8 | v38.23,46.35 38.23,44.7
  Bottom 1.016: 46.48,29.21 LCD_CON.8 v46.48,34.8
LCD_R4  (via drill 0.3, 0.6)
  Top 0.254: v36.96,47.62 36.96,46.35 40.64,42.67 40.64,38.61 44.2,35.05 44.45,35.05 v45.21,34.29 45.47,34.29 45.85,33.91 50.29,33.91 56.26,39.88 56.26,46.74 v56.39,46.86
  Bottom 0.254: 43.43,22.86 42.42,21.84 41.91,21.84 39.75,19.68 37.85,19.68 30.23,12.06 22.61,12.06 19.62,9.08 LCD.31 | LCD_CON.9 43.94,27.56 45.21,28.83 v45.21,34.29 44.58,34.92 40.51,34.92 39.75,35.69 38.23,35.69 36.96,36.96 LCD_LIME2.9 | v56.39,46.86 57.28,47.75 67.31,47.75 68.74,46.32 LCD_A64-OLINUXINO.9
  Bottom 0.762: v36.96,47.62 LCD_LIME.9
  Bottom 1.016: 43.43,22.86 43.94,23.37 LCD_CON.9
LCD_R5  (via drill 0.3, 0.6)
  Top 0.254: v39.75,39.5 39.75,38.73 43.94,34.54 v43.94,33.78 44.2,33.78 44.58,33.4 50.55,33.4 56.9,39.75 56.9,46.1 v57.78,46.99
  Bottom 0.254: 43.94,29.21 42.42,27.69 42.42,22.61 42.14,22.33 41.63,22.33 39.5,20.19 37.59,20.19 29.97,12.57 22.35,12.57 19.12,9.34 LCD.30 | v39.75,39.5 38.99,40.26 37.59,40.26 36.96,40.89 LCD_LIME2.10 | v57.78,46.99 58.04,47.24 67.06,47.24 68.24,46.06 LCD_A64-OLINUXINO.10
  Bottom 0.762: LCD_LIME2.10 LCD_LIME.10
  Bottom 1.016: 43.94,29.21 LCD_CON.10 v43.94,33.78
LCD_R6  (via drill 0.3, 0.6)
  Top 0.254: v35.69,47.62 35.69,46.86 38.86,43.69 38.86,37.34 v42.67,33.53 43.31,32.89 50.8,32.89 57.53,39.62 57.53,45.59 v57.91,45.97
  Bottom 0.254: 41.02,23.11 40.77,22.86 40.77,22.23 39.24,20.7 37.34,20.7 29.72,13.08 22.1,13.08 18.62,9.6 LCD.29 | LCD_CON.11 41.4,27.56 42.67,28.83 v42.67,33.53 41.78,34.42 40.26,34.42 39.5,35.18 37.97,35.18 36.96,36.2 36.32,36.2 35.69,36.83 LCD_LIME2.11 | v57.91,45.97 58.67,46.74 66.8,46.74 67.74,45.8 LCD_A64-OLINUXINO.11
  Bottom 0.762: v35.69,47.62 LCD_LIME.11
  Bottom 1.016: 41.02,23.11 41.4,23.5 LCD_CON.11
LCD_R7  (via drill 0.3, 0.6)
  Top 0.254: v37.97,39.37 37.97,37.47 41.4,34.04 v41.4,33.53 42.55,32.38 51.05,32.38 58.17,39.5 58.17,45.09 v59.05,45.97
  Bottom 0.254: 41.4,29.21 40.13,27.94 40.13,22.35 38.99,21.21 37.08,21.21 29.46,13.59 21.84,13.59 18.12,9.87 LCD.28 | v37.97,39.37 37.72,39.37 36.83,40.26 36.32,40.26 35.69,40.89 LCD_LIME2.12 | v59.05,45.97 59.31,46.23 66.55,46.23 67.24,45.53 LCD_A64-OLINUXINO.12
  Bottom 0.762: LCD_LIME2.12 LCD_LIME.12
  Bottom 1.016: 41.4,29.21 LCD_CON.12 v41.4,33.53
LCD_U/D  (via drill 0.6)
  Top 0.254: v25.27,8.76 28.45,8.76 29.97,7.24 36.83,7.24 36.96,7.37 39.24,7.37 39.62,6.99 v42.93,6.99
  Bottom 0.254: LCD.40 24.12,8.12 24.26,8.26 24.77,8.26 v25.27,8.76
  Bottom 1.016: R30.1 U/D.1 R24.2 v42.93,6.99
LCD_VSYNC  (via drill 0.3, 0.6)
  Top 0.254: v24.38,43.31 24,42.93 24,42.42 20.83,39.24 20.83,38.35 18.54,36.07 v18.54,33.78 28.96,23.37 36.7,23.37 36.83,23.24 55.63,23.24 60.96,28.57 v63.75,28.57
  Bottom 0.254: LCD.10 9.12,18.77 9.65,19.3 | 18.54,28.83 17.65,27.94 17.65,23.11 15.11,20.57 10.54,20.57 10.03,20.07 | LCD_A64-OLINUXINO.30 58.24,39.29 61.09,36.45 61.09,30.1 62.61,28.57 v63.75,28.57
  Bottom 0.762: 24.26,43.31 LCD_LIME2.30 | 24.26,43.31 LCD_LIME.30 | v24.38,43.31 24.26,43.31
  Bottom 1.016: 18.54,28.83 LCD_CON.30 v18.54,33.78 | 9.65,19.3 R4.2 10.03,20.07
N$1
  Bottom 0.254: LCD.8 8.12,10.04 7.49,10.67
  Bottom 1.016: R7.2 R6.2 7.49,10.67
N$2
  Bottom 1.016: D4.3 C14.2
N$3  (via drill 0.6)
  Top 0.762: v74.3,6.99 74.17,7.11 62.23,7.11 60.83,8.51 v52.58,8.51 | v40.77,47.62 41.15,48.01 43.56,48.01 43.69,47.88
  Top 1.016: 43.69,47.88 47.62,43.94 v47.62,40.77 v50.16,40.77 | v71.5,24.64 72.39,25.53 72.39,42.42 v71.75,43.05
  Bottom 0.254: LCD_A64-OLINUXINO.3 71.74,43.07 v71.75,43.05
  Bottom 0.508: LCD_LIME2.3 40.77,36.58 41.27,36.07 43.18,36.07 47.62,40.51 v47.62,40.77
  Bottom 0.762: 75.82,3.3 76.33,2.79 80.77,2.79 CTRL/EN.1 | v40.77,47.62 LCD_LIME.3
  Bottom 1.016: 75.82,3.3 C22.1 R2.2 75.82,7.16 FET2.2 75.59,6.99 v74.3,6.99 | v52.58,8.51 52.58,14.22 53.98,15.62 53.98,21.84 | v50.16,40.77 50.16,38.86 55.37,33.66 55.37,28.45 54.86,27.94 53.21,27.94 51.56,26.29 LCD_CON.3 51.56,23.5 53.21,21.84 53.98,21.84 | v71.5,24.64 71.5,21.97 70.23,20.7 63.12,20.7 61.98,21.84 53.98,21.84
N$4
  Bottom 1.016: D4.2 75.76,26.73 C11.1 R11.2
N$5
  Bottom 0.508: U1.3 58.67,15.53 58.67,15.75
  Bottom 1.016: R9.1 R8.1 58.67,16.76 58.67,15.75
N$6
  Bottom 1.016: D3.1 81.98,26.73 C10.1 R10.2
N$7
  Bottom 1.016: R1.2 C21.1 72.64,14.21 FET1.2 72.14,14.71 72.14,20.32 74.42,22.61 74.42,32.38 77.6,35.56 80.14,35.56 81.28,36.7 5V_JACK/5V_LCD_CON.2
N$8
  Bottom 1.016: C22.2 R2.1 77.6,7.09 FET2.1 78.11,7.6 78.11,13.21 78.49,13.59 78.49,14.21 D1.1
N$9
  Bottom 1.016: D1.2 76.56,14.35 74.57,14.35 FET1.1 74.48,12.63 C21.2 R1.1
N$10
  Bottom 1.016: D3.3 81.11,30.61 C13.1
N$11
  Bottom 1.016: T1.3 80.39,9.74 R32.1
N$12
  Bottom 1.016: R14.2 R9.2 C6.1
N$13
  Bottom 0.508: U1.1 58.67,13.53 58.67,13.21
  Bottom 1.016: D2.A 55.91,10.16 58.09,10.16 L1.2 58.67,10.24 58.67,13.21
N$14
  Bottom 1.016: Z3.1 57.53,17.83 R15.2 R13.1 R14.1
N$15  (via drill 0.3, 0.6)
  Top 0.254: v13.46,21.97 14.48,20.95 21.46,20.95 26.54,15.88 v38.35,15.88 | v21.72,47.62 22.35,46.99 22.35,45.97 21.59,45.21 21.59,42.29 19.3,40.01 19.3,39.12 14.73,34.54 v14.73,33.78 26.8,21.72 56.39,21.72 60.96,26.29 v62.87,26.29
  Bottom 0.254: 13.46,26.92 14.35,27.81 14.35,33.4 v14.73,33.78 16.13,35.18 19.05,35.18 19.56,35.69 20.57,35.69 21.72,36.83 LCD_LIME2.33 | LCD_A64-OLINUXINO.33 56.74,38.51 59.56,35.69 59.56,29.34 62.48,26.42 62.74,26.42 v62.87,26.29
  Bottom 0.762: v21.72,47.62 LCD_LIME.33
  Bottom 1.016: v13.46,21.97 LCD_CON.33 13.46,26.92 | v38.35,15.88 38.99,15.88 L/R.2
N$16
  Bottom 0.762: CTRL/EN.2 81.92,5.21
  Bottom 1.016: T1.1 81.92,6.96 81.92,5.21
N$17  (via drill 0.3, 0.6)
  Top 0.254: v13.46,28.32 12.06,29.72 5.97,29.72 3.3,27.05 3.3,17.4 4.7,16 7.87,16 9.27,17.4 11.43,17.4 22.23,6.6 37.34,6.6 v37.47,6.48 | v21.46,46.35 21.08,45.97 21.08,42.55 18.8,40.26 17.91,40.26 13.46,35.81 v13.46,33.78 26.04,21.21 56.64,21.21 60.96,25.53 63.37,25.53 v63.75,25.91
  Bottom 0.254: LCD_A64-OLINUXINO.34 56.24,38.25 59.05,35.43 59.05,28.96 62.48,25.53 63.37,25.53 v63.75,25.91
  Bottom 0.508: v37.47,6.48 37.47,5.71 38.23,4.95 39.24,4.95 | LCD_LIME.34 21.72,46.1 v21.46,46.35
  Bottom 0.762: LCD_LIME.34 21.72,43.94 21.46,43.69 21.46,42.67 21.72,42.42 LCD_LIME2.34
  Bottom 1.016: v13.46,28.32 LCD_CON.34 v13.46,33.78 | 39.24,4.95 U/D.2
N$18  (via drill 0.6)
  Top 0.762: v70.74,16.13 v74.68,16.13
  Bottom 0.762: 3.3V/5V.1 70.74,11.16 v70.74,16.13
  Bottom 1.016: FET1.3 73.87,16.13 v74.68,16.13
N$19
  Bottom 1.016: D1.3 77.81,16.26 R32.2
N$20  (via drill 0.6)
  Top 1.016: v42.93,46.74 46.35,43.31 v46.35,40.77 46.35,40.13 46.99,39.5 v51.44,39.5
  Bottom 0.254: LCD_A64-OLINUXINO.1 72.74,44.61 72.9,44.45
  Bottom 0.508: LCD_LIME2.1 42.04,38.1 43.81,38.1 46.35,40.64 v46.35,40.77 | 72.9,44.45 73.15,44.2 73.15,43.81
  Bottom 0.762: v42.93,46.74 42.04,47.62 LCD_LIME.1
  Bottom 1.016: LCD_CON.1 54.1,26.42 55.24,26.42 56.64,27.81 | 73.15,36.96 78.74,36.96 5V_JACK/5V_LCD_CON.3 | v51.44,39.5 56.64,34.29 56.64,27.81 | 73.15,36.96 73.15,43.81 | 73.15,36.96 73.15,26.42 72.64,25.91 70.74,25.91 70.23,25.4 70.23,22.61 69.6,21.97 63.75,21.97 62.61,23.11 61.34,23.11 56.64,27.81
N$21
  Bottom 0.254: LCD.1 4.62,8.26 | LCD.2 5.12,8.09 4.95,8.26 4.62,8.26 | 4.62,8.26 4.62,8.71 3.3,10.03 0.89,10.03
  Bottom 0.508: 0.89,10.03 0.64,10.29 0.64,17.91 1.14,18.41
  Bottom 1.016: 1.14,18.41 VLED+_E.1
N$22
  Bottom 1.016: 5V_JACK/5V_LCD_CON.1 83.82,38.23 84.96,38.23
  Bottom 1.778: PWR_JACK.1 87.34,38.23 84.96,38.23
N$23
  Bottom 0.254: 5.62,8.26 LCD.3 | 5.62,8.26 5.62,8.6 3.68,10.54 1.52,10.54 1.4,10.67 | LCD.4 6.12,8.1 5.97,8.26 5.62,8.26
  Bottom 0.508: 1.65,16.38 1.4,16.13 1.4,10.67
  Bottom 1.016: 1.65,16.38 VLED-_E.1
N$42  (via drill 0.6)
  Top 0.254: v30.61,8.13 33.02,8.13 v33.27,8.38
  Bottom 0.254: LCD.47 27.62,8.19 27.81,8.38 30.35,8.38 v30.61,8.13
  Bottom 1.016: v33.27,8.38 R20.2 R19.2
N$123
  Bottom 0.508: 85.67,14.99 L2.2 | U2.1 88.49,14.99 88.27,14.99
  Bottom 1.016: C14.1 C13.2 84.84,32.38 85.34,31.88 85.34,17.91 | 85.67,14.99 88.27,14.99 | 85.34,17.91 D5.A | L2.2 85.34,17.91
N$126  (via drill 0.6)
  Top 0.762: v91.57,12.7 91.44,12.83 v91.44,14.99
  Bottom 0.508: U2.3 90.48,14.99 v91.44,14.99
  Bottom 1.016: R26.1 R18.1 93.34,10.92 v91.57,12.7
RESET
  Bottom 0.254: LCD.44 26.12,8.21 27.43,9.53 32.13,9.53 33.78,11.18
  Bottom 1.016: 34.42,11.81 R23.2 | C20.1 35.69,13.08 34.42,11.81 | 33.78,11.18 34.42,11.81
TPX1  (via drill 0.3, 0.6)
  Top 0.254: v93.09,4.95 90.17,7.87 62.61,7.87 61.09,9.4 48.39,9.4 v45.97,11.81 45.47,12.32 25.53,12.32 19.94,17.91 9.02,17.91 7.62,16.51 4.95,16.51 3.81,17.65 3.81,20.83 5.46,22.48 7.87,22.48 v8.38,21.97 | v9.65,35.56 10.16,35.56 15.88,41.27 15.88,46.61 v16.76,47.5 18.03,48.77 44.45,48.77 v45.21,48.01
  Bottom 0.254: v16.76,47.5 16.89,47.62 18.92,47.62 19.18,47.88 | 8.38,26.92 9.65,28.19 v9.65,35.56 10.29,36.2 18.54,36.2 19.18,36.83 LCD_LIME2.37 | LCD_A64-OLINUXINO.37 54.74,46.86 52.7,48.9 49.28,48.9 48.9,48.51 45.72,48.51 v45.21,48.01
  Bottom 0.508: LCD.55 46.66,12.5 v45.97,11.81 44.2,10.03 | LCD.51 92.86,5.18 v93.09,4.95
  Bottom 0.762: 19.18,47.88 LCD_LIME.37
  Bottom 1.016: v8.38,21.97 LCD_CON.37 8.38,26.92 | 44.2,10.03 R27.2
TPX2  (via drill 0.3, 0.6)
  Top 0.254: v8.38,28.32 15.24,21.46 21.72,21.46 26.42,16.76 47.88,16.76 v48.77,15.88 50.42,15.88 51.82,17.27 55.75,17.27 57.15,18.67 59.05,18.67 63.25,22.86 65.28,22.86 v65.53,23.11 | v94.87,4.83 94.74,4.95 94.74,8.64 94.11,9.27 62.74,9.27 61.59,10.41 50.04,10.41 v48.77,11.68 | v8.38,33.78 9.14,33.78 16.38,41.02 16.38,45.85 v16.76,46.23
  Bottom 0.254: LCD_LIME.38 19.18,45.47 18.54,46.1 16.89,46.1 v16.76,46.23 | LCD_A64-OLINUXINO.38 54.24,43.67 54.74,43.18 54.74,37.47 57.53,34.67 57.53,28.19 61.72,24 62.99,24 64.14,22.86 65.28,22.86 v65.53,23.11
  Bottom 0.508: LCD.57 48.66,16.11 48.77,16 v48.77,15.88 v48.77,11.68 | LCD.53 v94.87,4.83
  Bottom 0.762: LCD_LIME.38 LCD_LIME2.38
  Bottom 1.016: v8.38,28.32 LCD_CON.38 v8.38,33.78
TPY1  (via drill 0.3, 0.6)
  Top 0.254: v93.73,8.38 62.87,8.38 61.34,9.91 49.28,9.91 v47.5,11.68 46.35,12.83 25.78,12.83 20.19,18.41 8.76,18.41 7.37,17.02 5.21,17.02 4.32,17.91 4.32,20.07 v5.84,21.59 | v7.11,33.78 7.11,34.29 9.27,36.45 10.29,36.45 15.37,41.53 15.37,47.37 v16.76,48.77 17.27,49.28 45.09,49.28 45.97,48.39 v45.97,47.37
  Bottom 0.254: 5.84,26.92 7.11,28.19 v7.11,33.78 7.11,34.29 9.53,36.7 17.91,36.7 LCD_LIME2.39 | LCD_A64-OLINUXINO.39 53.74,43.71 53.59,43.56 49.78,43.56 v45.97,47.37
  Bottom 0.508: LCD.52 93.86,8.24 v93.73,8.38 | LCD.56 47.66,11.85 v47.5,11.68 44.32,8.51
  Bottom 0.762: v16.76,48.77 17.91,48.77 LCD_LIME.39
  Bottom 1.016: 44.32,8.51 R28.2 | v5.84,21.59 LCD_CON.39 5.84,26.92
TPY2  (via drill 0.3, 0.6)
  Top 0.254: v5.84,28.32 6.73,29.21 8.76,29.21 16,21.97 21.97,21.97 26.67,17.27 48.13,17.27 48.51,16.89 v49.91,16.89 | v95.76,8.38 94.36,9.78 62.99,9.78 61.85,10.92 51.44,10.92 v49.91,12.45 | v15.49,48.77 16.51,49.78 45.34,49.78 46.86,48.26 v46.86,47.75
  Bottom 0.254: 5.84,33.78 9.27,37.21 14.99,37.21 17.91,40.13 | 16.64,44.83 15.49,45.97 v15.49,48.77 | LCD_A64-OLINUXINO.40 53.24,44.07 50.04,44.07 46.86,47.24 v46.86,47.75
  Bottom 0.508: LCD.54 95.86,8.28 v95.76,8.38 | LCD.58 49.66,17.39 49.91,17.14 v49.91,16.89 v49.91,12.45 | 17.91,40.13 LCD_LIME2.40
  Bottom 0.762: LCD_LIME2.40 LCD_LIME.40 16.64,44.83
  Bottom 1.016: v5.84,28.32 LCD_CON.40 5.84,33.78
VCC  (via drill 0.6)
  Top 0.508: v55.5,15.24 57.78,17.53 59.69,17.53 63.88,21.72 66.8,21.72 67.82,22.73 v67.82,23.37
  Top 1.016: 7.49,10.29 v7.49,14.61 8.64,14.61 v10.03,16 | 7.49,10.29 7.49,5.71 10.03,3.17 22.99,3.17 24.26,4.45 34.16,4.45 34.92,5.21 38.73,5.21 | 7.49,10.29 v6.1,10.29 | 38.73,5.21 v38.73,6.48 | 38.73,5.21 42.8,5.21 v44.07,3.94 | v72.01,4.7 67.31,4.7 PWR.5
  Bottom 0.254: v6.1,10.29 7.62,8.76 LCD.7 | R13.2 55.63,20.57 54.86,19.81 54.86,15.88 | 54.99,15.75 55.12,15.62 | v55.5,15.24 55.12,15.62 | 54.86,15.88 54.99,15.75 | 54.86,14.61 54.86,15.88 | 54.99,14.73 54.99,15.75 | 55.12,14.86 55.12,15.62
  Bottom 0.508: 53.85,3.94 53.85,13.59 54.86,14.61 54.99,14.73 55.12,14.86 v55.5,15.24 | v67.82,23.37 67.82,26.67 67.44,27.05 65.79,27.05 65.53,27.3 65.53,32.77 66.29,33.53 R34.2
  Bottom 0.762: 3.3V/5V.3 71.97,7.83 72.01,7.83
  Bottom 1.016: v6.1,10.29 5.21,10.29 4.45,11.05 C2.1 C1.1 | R5.1 R4.1 v10.03,16 | v7.49,14.61 R6.1 | R27.1 R28.1 R24.1 39.24,6.99 v38.73,6.48 | R27.1 R25.1 | 36.2,10.03 R19.1 | 36.2,10.03 R23.1 | PWR.5 63.25,3.94 53.85,3.94 v44.07,3.94 | FET2.3 73.49,9.36 71.97,7.83 | v72.01,4.7 72.01,7.83 | R27.1 36.2,10.03 | R34.2 R36.2 R38.2 R40.2
VCOM  (via drill 0.6)
  Top 0.254: 61.72,1.65 61.09,1.02 42.55,1.02 40.13,3.43 v35.81,3.43
  Top 0.508: v27.05,5.71 24,5.71 22.48,4.19 10.92,4.19 v10.29,4.83
  Top 1.016: 61.72,1.65 PWR.4
  Bottom 0.254: 33.53,6.86 31.37,9.02 27.69,9.02 27.12,8.45 LCD.46 27.12,5.78 v27.05,5.71 | LCD.6 7.12,6.09 8.38,4.83 v10.29,4.83
  Bottom 1.016: 34.54,3.51 Z4.1 34.42,3.63 R29.1 C19.1 33.53,6.86 | 34.54,3.51 34.42,3.51 R22.2 | 34.54,3.51 34.62,3.43 v35.81,3.43
VLED+  (via drill 0.6)
  Top 0.508: v5.97,20.19 4.95,19.18 4.95,18.16 5.46,17.65 7.11,17.65 8.51,19.05 20.57,19.05 26.16,13.46 59.31,13.46 v60.2,14.35 62.1,14.35 v64.52,11.94
  Top 0.762: 71.37,0.89 71.5,0.76 73.41,0.76 73.53,0.89
  Top 1.016: PWR.7 71.37,0.89 | 73.53,0.89 97.54,0.89 98.81,2.16 v98.81,10.86
  Bottom 0.508: v60.2,14.35 60.33,14.48 U1.5 | 64.52,5.21 64.26,4.95 57.78,4.95 57.53,5.21
  Bottom 1.016: VLED+_E.2 4.45,20.19 v5.97,20.19 | PWR.7 68.07,4.19 65.53,4.19 64.52,5.21 C3.1 C4.1 C5.1 v64.52,11.94 | D2.K 55.98,5.21 57.53,5.21
  Bottom 2.032: VLED+.1 98.3,11.94
  Bottom 2.159: 99.31,11.94 VLED+.1 v98.81,10.86
VLED-  (via drill 0.6)
  Top 0.508: v5.97,18.67 6.99,18.67 8.13,19.81 20.95,19.81 26.54,14.22 58.42,14.22 61.47,17.27 v62.74,17.27
  Top 1.016: v62.74,17.27 62.87,17.4 98.68,17.4 v98.81,17.27
  Bottom 1.016: VLED-_E.2 4.45,17.14 v5.97,18.67 | R8.2 v62.74,17.27 R12.1
  Bottom 2.032: VLED-.1 98.3,18.41
  Bottom 2.159: 99.31,18.41 VLED-.1 v98.81,17.27

## Text on the board
Top: 2 Layers PCB | 1 error | 31 total errors
Bottom: 30 errors
bNames: LCD-OLINUXINO-10''TS | (C) 2017 | Rev.C | +5V_ONLY | 1 | https://www.olimex.com | + | 3.3V/ | +20V | +10.8V | 5V | +3.75V | +3.3V | -8.2V | 9.7V | GND